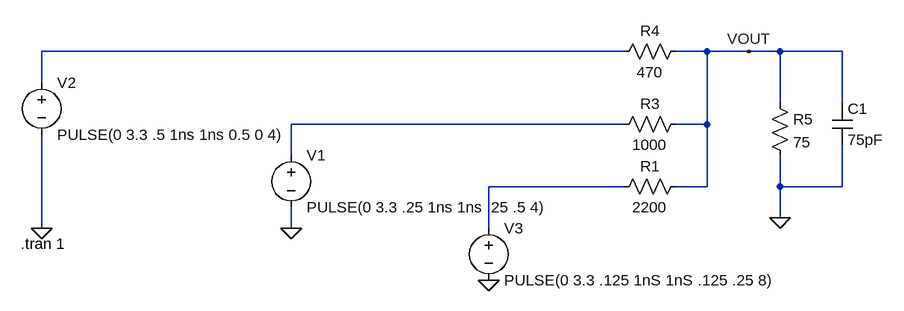
[diagram p0: schematic DAC_Sim_3bit.asc]
DAC_Sim_3bit.asc, the LTspice schematic file:
Version 4
SHEET 1 880 680
WIRE -64 -32 -960 -32
WIRE 64 -32 16 -32
WIRE 128 -32 64 -32
WIRE 176 -32 128 -32
WIRE 272 -32 176 -32
WIRE -960 16 -960 -32
WIRE 176 48 176 -32
WIRE 272 48 272 -32
WIRE -64 80 -576 80
WIRE 64 80 64 -32
WIRE 64 80 16 80
WIRE -576 128 -576 80
WIRE -64 176 -272 176
WIRE 64 176 64 80
WIRE 64 176 16 176
WIRE 176 176 176 128
WIRE 272 176 272 112
WIRE 272 176 176 176
WIRE 176 224 176 176
WIRE -960 240 -960 96
WIRE -576 240 -576 208
WIRE -272 240 -272 176
FLAG -576 240 0
FLAG -960 240 0
FLAG 176 224 0
FLAG 128 -32 VOUT
FLAG -272 320 0
SYMBOL res 32 64 R90
WINDOW 0 0 56 VBottom 2
WINDOW 3 32 56 VTop 2
SYMATTR InstName R3
SYMATTR Value 1000
SYMBOL res 32 -48 R90
WINDOW 0 0 56 VBottom 2
WINDOW 3 32 56 VTop 2
SYMATTR InstName R4
SYMATTR Value 470
SYMBOL voltage -576 112 R0
WINDOW 123 0 0 Left 0
WINDOW 39 0 0 Left 0
SYMATTR InstName V1
SYMATTR Value PULSE(0 3.3 .25 1ns 1ns .25 .5 4)
SYMBOL voltage -960 0 R0
WINDOW 123 0 0 Left 0
WINDOW 39 0 0 Left 0
SYMATTR InstName V2
SYMATTR Value PULSE(0 3.3 .5 1ns 1ns 0.5 0 4)
SYMBOL res 160 32 R0
SYMATTR InstName R5
SYMATTR Value 75
SYMBOL res 32 160 R90
WINDOW 0 0 56 VBottom 2
WINDOW 3 32 56 VTop 2
SYMATTR InstName R1
SYMATTR Value 2200
SYMBOL cap 256 48 R0
SYMATTR InstName C1
SYMATTR Value 75pF
SYMBOL voltage -272 224 R0
WINDOW 123 0 0 Left 0
WINDOW 39 0 0 Left 0
SYMATTR InstName V3
SYMATTR Value PULSE(0 3.3 .125 1nS 1nS .125 .25 8)
TEXT -992 264 Left 2 !.tran 1

The netlist it stands for:
* DAC_Sim_3bit.asc
R3 VOUT N002 1000
R4 VOUT N001 470
V1 N002 0 PULSE(0 3.3 .25 1ns 1ns .25 .5 4)
V2 N001 0 PULSE(0 3.3 .5 1ns 1ns 0.5 0 4)
R5 VOUT 0 75
R1 VOUT N003 2200
C1 VOUT 0 75pF
V3 N003 0 PULSE(0 3.3 .125 1nS 1nS .125 .25 8)
.tran 1
.backanno
.end